# EAGLE design preamp-buffer-supreme v1.0 (EAGLE 6.5.0)
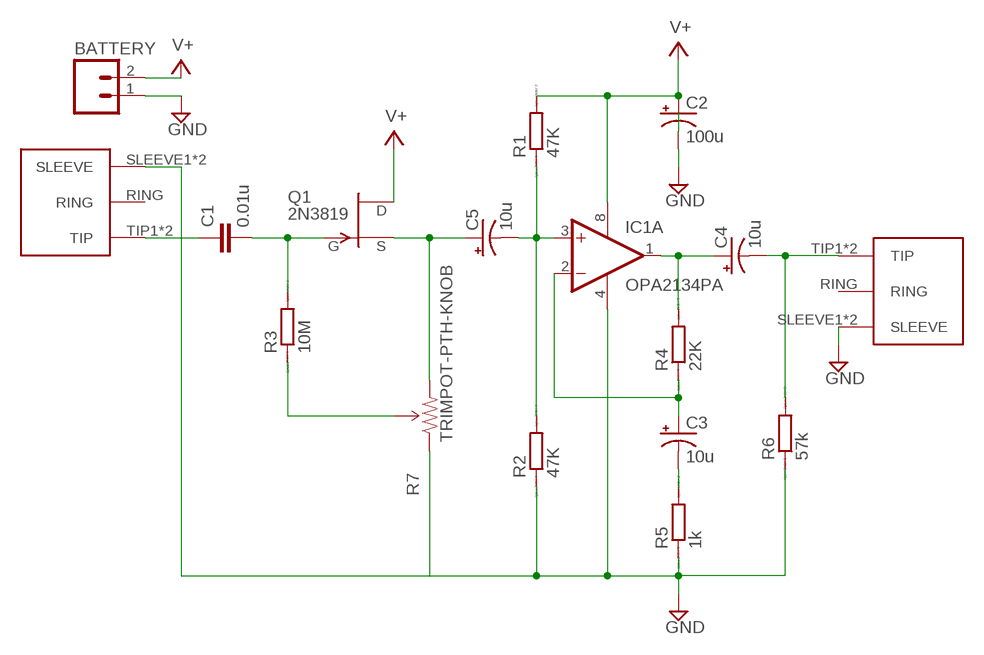
[diagram p0: schematic, sheet 1]

## Parts
BATTERY  M02PTH  [1X02]
C1  0.01u  C5/3  [C5B3]
C2  100u  CAP_POLPTH2  [CPOL-RADIAL-10UF-25V]
C3  10u  CAP_POLPTH2  [CPOL-RADIAL-10UF-25V]
C4  10u  CAP_POLPTH2  [CPOL-RADIAL-10UF-25V]
C5  10u  CAP_POLPTH2  [CPOL-RADIAL-10UF-25V]
IC1  OPA2134PA  [DIL08]
Q1  2N3819  [TO92]
R1  47K  R0204/7  [0204/7]
R2  47K  R0204/7  [0204/7]
R3  10M  R0204/7  [0204/7]
R4  22K  R0204/7  [0204/7]
R5  1k  R0204/7  [0204/7]
R6  57k  R0204/7  [0204/7]
R7  TRIMPOT-PTH-KNOB  [3386U]
U$2  3.5MM-STEREO-JACK  [3.5MM-STEREO-JACK]
U$3  3.5MM-STEREO-JACK  [3.5MM-STEREO-JACK]

## Nets
GND: BATTERY.1 C2.2(-) IC1.4(A:V-) R2.1 R5.1 R6.1 R7.1(CCW) U$2.SLEEVE1(SLEEVE) U$2.SLEEVE2(SLEEVE) U$3.SLEEVE1(SLEEVE) U$3.SLEEVE2(SLEEVE)
JFET-GATE: C1.2 Q1.2(G) R3.2
JFET-SOURCE: C5.1(+) Q1.3(S) R7.3(CW)
N$1: C1.1 U$2.TIP1(TIP) U$2.TIP2(TIP)
N$3: R3.1 R7.2(WIPER)
N$6: C5.2(-) IC1.3(A:+IN) R1.1 R2.2
N$7: C4.1(+) IC1.1(A:OUT) R4.2
N$9: C3.2(-) R5.2
N$10: C4.2(-) R6.2 U$3.TIP1(TIP) U$3.TIP2(TIP)
N$11: C3.1(+) IC1.2(A:-IN) R4.1
V+: BATTERY.2 C2.1(+) IC1.8(A:V+) Q1.1(D) R1.2
Unconnected: IC1.5(B:+IN) IC1.6(B:-IN) IC1.7(B:OUT) U$2.RING U$3.RING

## Library data of the parts
BATTERY = SparkFun-Connectors:M02: Header 2 Standard 2-pin 0.1" header. Use with straight break away headers (SKU : PRT-00116), right angle break away headers (PRT-00553), swiss pins (PRT-00743), machine pins (PRT-00117), and female headers (PRT-00115). Molex polarized connector foot print use with SKU : PRT-08233 with associated crimp pins and housings.
C1 = capacitor-wima:C: CAPACITOR naming: grid - package width
C2-C5 = SparkFun-Passives:CAP_POL: Capacitor Polarized These are standard SMD and PTH capacitors. Normally 10uF, 47uF, and 100uF in electrolytic and tantalum varieties. Always verify the external diameter of the through hole cap, it varies with capacity, voltage, and manufacturer. The EIA devices should be standard.
IC1 = linear:OPA2*: Dual Operational Amplifier Low Power, Single-Supply, Rail-To-Rail Operational Amplifier Source: http://focus.ti.com/lit/ds/symlink/opa2345.pdf http://focus.ti.com .. opa241.pdf http://focus.ti.com/lit/ds/symlink/opa2134.pdf
Q1 = aliEagleLib:2N3819: N-Channel Junction FET
R1-R6 = eagle-ltspice:R: RESISTOR, European symbol; SPICEMODEL: NONE; SPICEPREFIX: R
R7 = SparkFun-Electromechanical:TRIMPOT: Various small potentiometers for "set-and-forget" applications
U$2 U$3 = aliEagleLib:3.5MM-STEREO-JACK

## Board
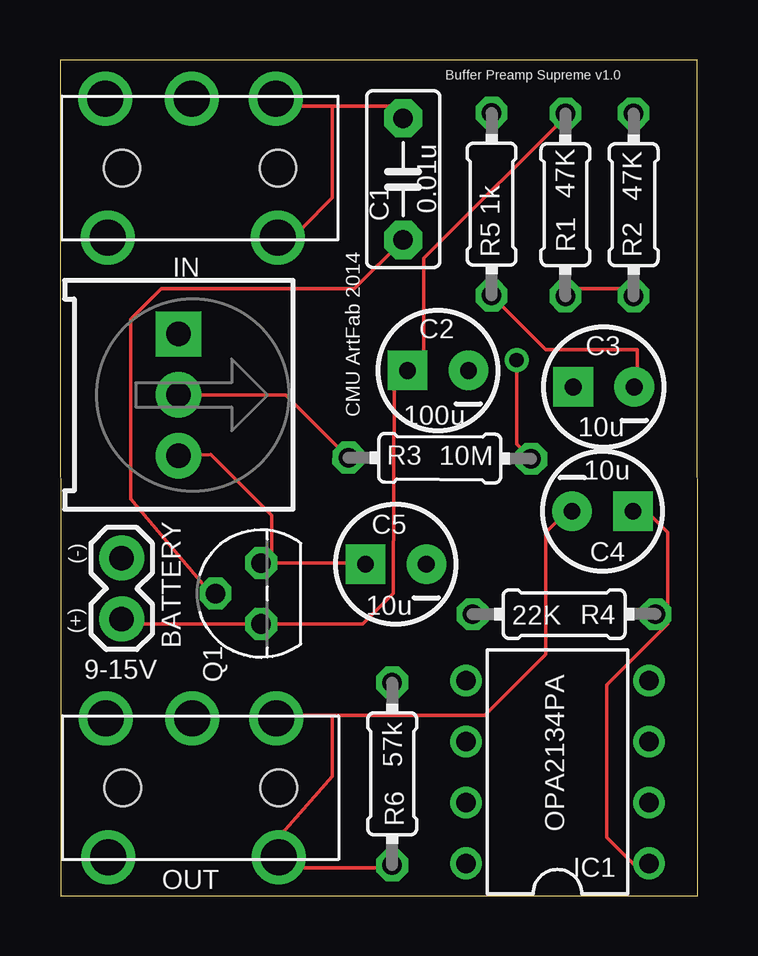
[diagram p1: board, top side]
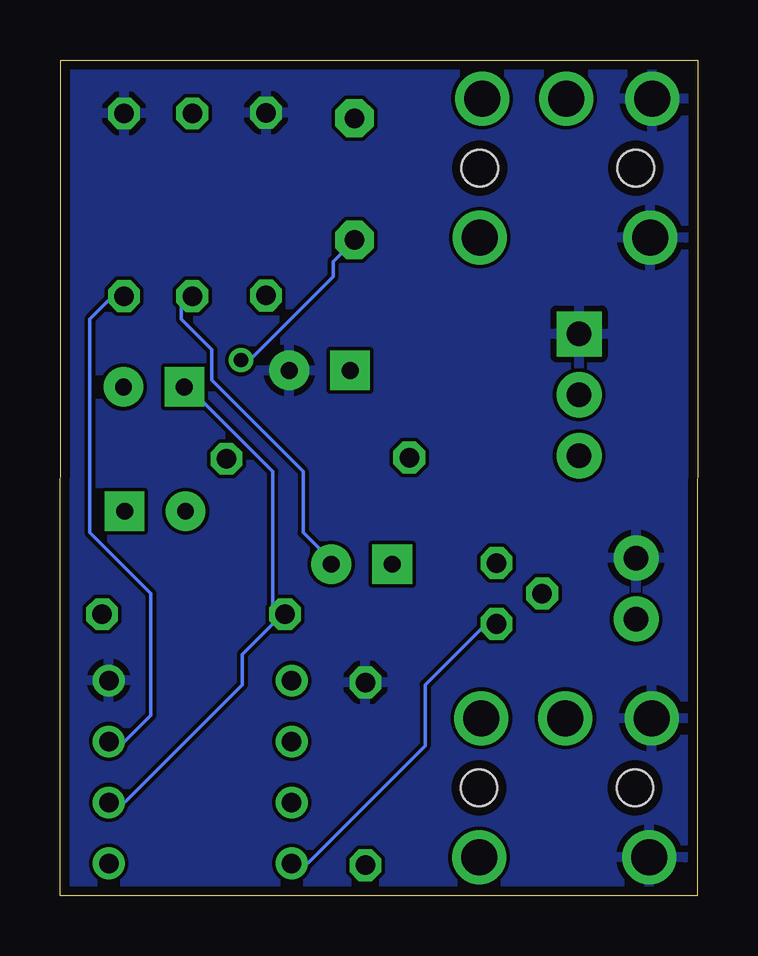
[diagram p2: board, bottom side, seen from below]

Size 26.57 x 34.84 mm. Coordinates in mm from the lower left corner, seen from the top.
Outline: 0.03,0 26.57,0 26.54,34.84 0,34.84 0.03,0
Copper layers (1*16): Top 0.035mm / dielectric 1.5mm / Bottom 0.035mm
Design rules "default *": minimum track width 6mil, minimum drill 13mil, track to track 6mil, track to pad 6mil, pad to pad 6mil, via to via 6mil, smd to smd 6mil, copper to edge 15mil, drill to drill 8mil, minimum pad ring 10mil, minimum via ring 8mil, stop-mask expansion 4mil, vias tented up to drill 0mil, thermal gap 10mil

### Footprints (pad centres in the part's own frame; a part is rotated, then mirrored left to right if it is on the bottom)
1X02 = drill 1.016 pad 1.88: 1 0,0; 2 2.54,0
C5B3 = drill 0.813 pad 1.6 octagon: 1 -2.54,0; 2 2.54,0
CPOL-RADIAL-10UF-25V = drill 0.7 pad 1.651 square: 1 1.27,0 | drill 0.7 pad 1.651: 2 -1.27,0
DIL08 = drill 0.813 pad 1.27: 1 -3.81,-3.81; 2 -1.27,-3.81; 3 1.27,-3.81; 4 3.81,-3.81; 5 3.81,3.81; 6 1.27,3.81; 7 -1.27,3.81; 8 -3.81,3.81
TO92 = drill 0.813 octagon: 1 -1.27,0; 2 0,1.905; 3 1.27,0
0204/7 = drill 0.813 octagon: 1 -3.81,0; 2 3.81,0
3386U = drill 1.016 pad 1.88 square: 1 -2.54,-0.015 | drill 1.016 pad 1.88: 2 0,-0.015; 3 2.54,-0.015
3.5MM-STEREO-JACK = drill 1.5: RING 5.9,6.1; SLEEVE1 0.1,9.6; SLEEVE2 5.9,9.7; TIP1 0.1,2.5; TIP2 5.9,2.6 | hole 1.52: 3,9; 3,2.5

### Placement (x,y rotation side)
BATTERY  2.57,14.07 270 top
C1  14.3,29.87 270 top
C2  15.75,21.89 180 top
C3  22.66,21.21 180 top
C4  22.61,16.03 0 top
C5  14,13.82 180 top
IC1  20.73,5.16 90 top
Q1  8.38,12.6 90 top
R1  21.06,28.8 90 top
R2  23.9,28.8 270 top
R3  15.82,18.24 359.6 top
R4  21.01,11.73 0 top
R5  17.98,28.83 270 top
R6  13.84,5.08 270 top
R7  4.95,20.88 270 top
U$2  11.58,27.33 90 top
U$3  11.61,1.5 90 top

### Tracks (layer width: path | path; a pad name or v marks a point on that pad's centre or on a via)
GND
  pour Bottom: 0.2,0 0.18,34.85 26.09,34.85 26.11,0
JFET-GATE  (via drill 0.6)
  Top 0.152: Q1.2 6.27,12.6 2.95,16.54 2.95,24.03 4.22,25.3 12.27,25.3 C1.2 13.89,26.9 | R3.2 19.02,18.82 v19.02,22.33
  Bottom 0.152: v19.02,22.33 18.67,22.33 15.19,25.81 15.19,26.44 C1.2
JFET-SOURCE
  Top 0.152: 8.81,13.87 12.62,13.87 C5.1 | 8.81,13.87 8.81,15.85 6.27,18.39 R7.3 | 8.81,13.87 Q1.3
N$1
  Top 0.152: 11.35,32.92 10.08,32.92 U$2.TIP2 | 11.35,32.92 13.89,32.92 C1.1 | 11.35,32.92 11.35,29.11 10.08,27.84 U$2.TIP1
N$3
  Top 0.152: R3.1 9.4,20.88 R7.2
N$6
  Top 0.152: R1.1 21.51,25.3 24.05,25.3 R2.2
  Bottom 0.152: IC1.3 24.05,6.25 22.78,7.52 22.78,12.6 25.32,15.14 25.32,24.03 24.05,25.3 R2.2 | C5.2 15.16,13.87 16.43,15.14 16.43,17.68 20.24,21.49 20.24,22.76 21.51,24.03 21.51,25.3 R1.1
N$7
  Top 0.152: 25.32,11.33 22.78,8.79 22.78,2.44 24.05,1.17 IC1.1 | 25.32,11.33 25.32,15.14 24.05,16.41 C4.1 | 25.32,11.33 R4.2
N$9
  Top 0.152: R5.2 20.24,22.76 24.05,22.76 24.05,21.49 C3.2
N$10
  Top 0.152: R6.2 13.89,1.17 10.08,1.17 U$3.TIP1 9.09,2.41 11.35,4.98 11.35,7.52 | 11.35,7.52 10.08,7.52 U$3.TIP2 | 11.35,7.52 17.7,7.52 20.24,10.06 20.24,15.14 21.51,16.41 C4.2
N$11
  Bottom 0.152: 17.7,11.33 18.97,10.06 18.97,8.79 24.05,3.71 IC1.2 | 17.7,11.33 17.7,17.68 21.51,21.49 C3.1 | 17.7,11.33 R4.1
V+
  Top 0.152: R1.2 21.51,32.92 15.16,26.57 15.16,22.38 C2.1 13.92,21.39 13.89,12.6 12.62,11.33 Q1.1 2.46,11.33 BATTERY.2
  Bottom 0.152: IC1.8 16.43,1.17 11.35,6.25 11.35,8.79 8.81,11.33 Q1.1

### Text on the board
tNames: Buffer Preamp Supreme v1.0 | CMU ArtFab 2014